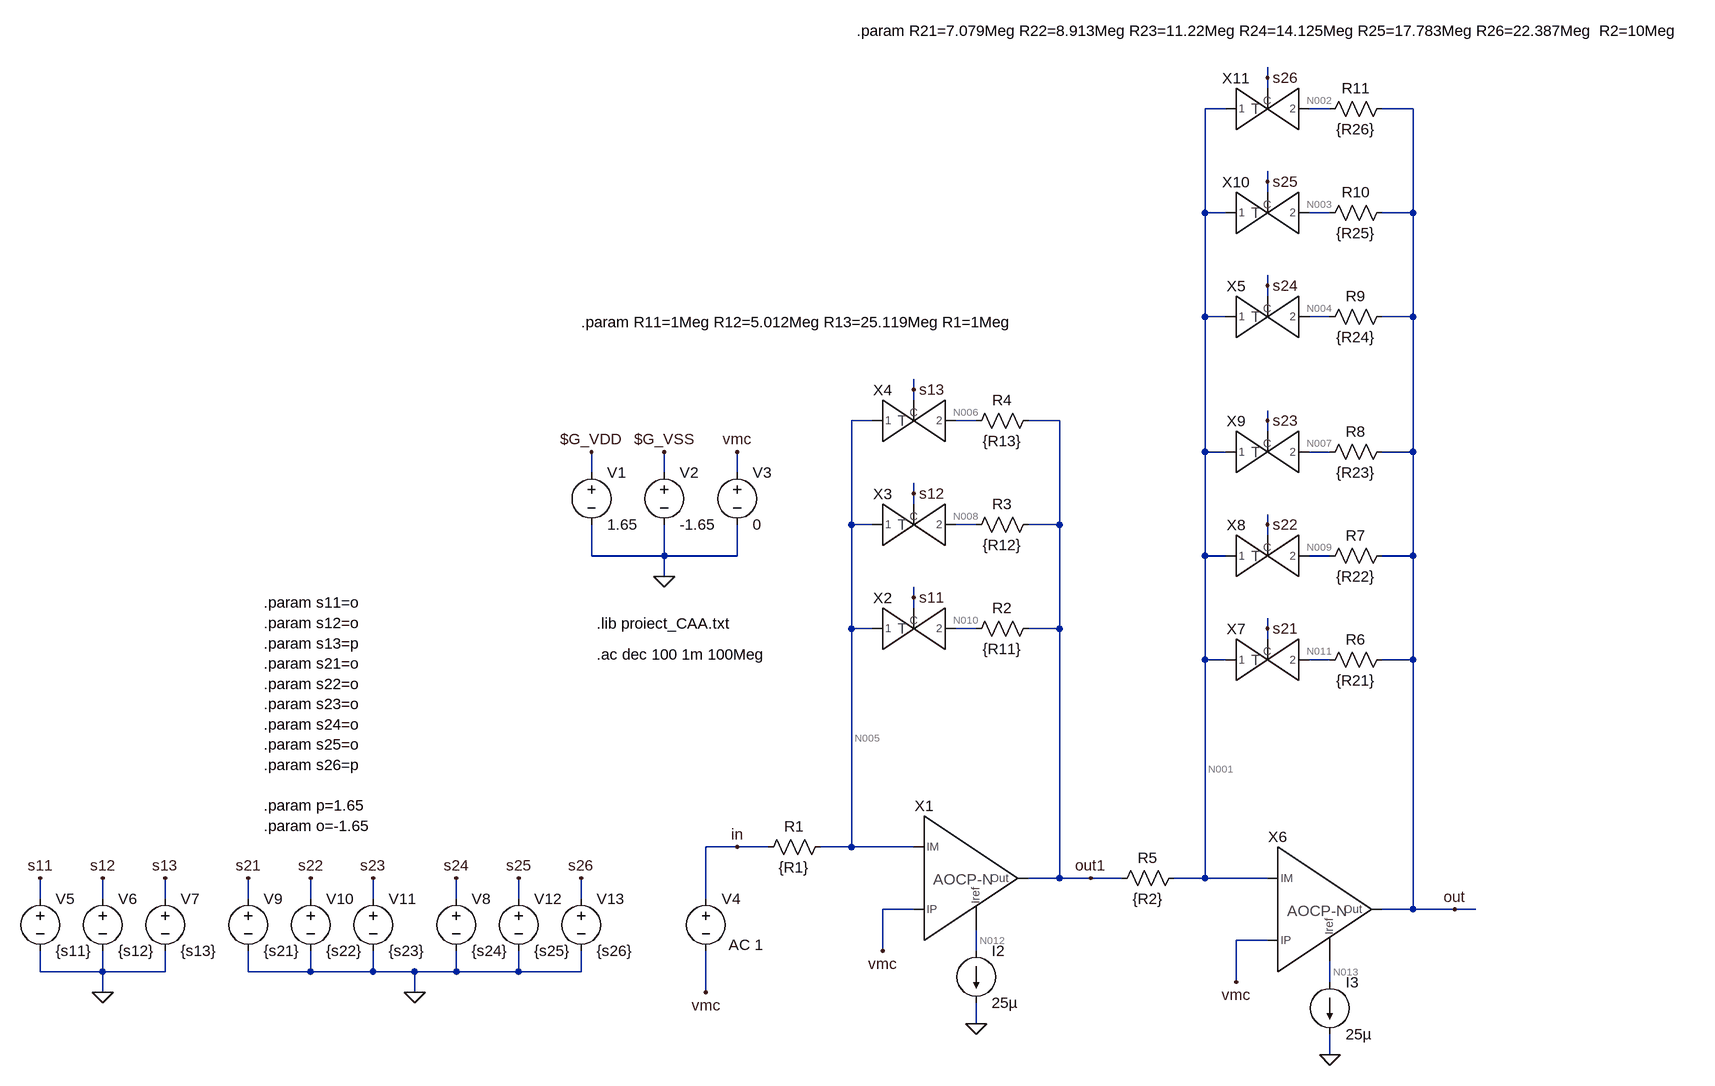
[diagram p0: schematic test_pga2.asc]
test_pga2.asc, the LTspice schematic file:
Version 4
SHEET 1 2632 1328
WIRE 1248 -352 1248 -368
WIRE 1248 -336 1248 -352
WIRE 1184 -304 1152 -304
WIRE 1344 -304 1312 -304
WIRE 1472 -304 1424 -304
WIRE 1248 -192 1248 -208
WIRE 1248 -176 1248 -192
WIRE 1152 -144 1152 -304
WIRE 1184 -144 1152 -144
WIRE 1344 -144 1312 -144
WIRE 1472 -144 1472 -304
WIRE 1472 -144 1424 -144
WIRE 1248 -32 1248 -48
WIRE 1248 -16 1248 -32
WIRE 1152 16 1152 -144
WIRE 1184 16 1152 16
WIRE 1344 16 1312 16
WIRE 1472 16 1472 -144
WIRE 1472 16 1424 16
WIRE 704 128 704 112
WIRE 704 144 704 128
WIRE 640 176 608 176
WIRE 800 176 768 176
WIRE 928 176 880 176
WIRE 1248 176 1248 160
WIRE 1248 192 1248 176
WIRE 1152 224 1152 16
WIRE 1184 224 1152 224
WIRE 1344 224 1312 224
WIRE 1472 224 1472 16
WIRE 1472 224 1424 224
WIRE 208 256 208 224
WIRE 320 256 320 224
WIRE 432 256 432 224
WIRE 704 288 704 272
WIRE 704 304 704 288
WIRE 608 336 608 176
WIRE 640 336 608 336
WIRE 800 336 768 336
WIRE 928 336 928 176
WIRE 928 336 880 336
WIRE 1248 336 1248 320
WIRE 1248 352 1248 336
WIRE 208 384 208 336
WIRE 320 384 320 336
WIRE 320 384 208 384
WIRE 432 384 432 336
WIRE 432 384 320 384
WIRE 1152 384 1152 224
WIRE 1184 384 1152 384
WIRE 1344 384 1312 384
WIRE 1472 384 1472 224
WIRE 1472 384 1424 384
WIRE 320 416 320 384
WIRE 704 448 704 432
WIRE 704 464 704 448
WIRE 608 496 608 336
WIRE 640 496 608 496
WIRE 800 496 768 496
WIRE 928 496 928 336
WIRE 928 496 880 496
WIRE 1248 496 1248 480
WIRE 1248 512 1248 496
WIRE 1152 544 1152 384
WIRE 1184 544 1152 544
WIRE 1344 544 1312 544
WIRE 1472 544 1472 384
WIRE 1472 544 1424 544
WIRE 432 832 384 832
WIRE 480 832 432 832
WIRE 608 832 608 496
WIRE 608 832 560 832
WIRE 704 832 608 832
WIRE 928 880 928 496
WIRE 928 880 880 880
WIRE 976 880 928 880
WIRE 1024 880 976 880
WIRE 1152 880 1152 544
WIRE 1152 880 1104 880
WIRE 1248 880 1152 880
WIRE -640 912 -640 880
WIRE -544 912 -544 880
WIRE -448 912 -448 880
WIRE -320 912 -320 880
WIRE -224 912 -224 880
WIRE -128 912 -128 880
WIRE 0 912 0 880
WIRE 96 912 96 880
WIRE 192 912 192 880
WIRE 384 912 384 832
WIRE 704 928 656 928
WIRE 1472 928 1472 544
WIRE 1472 928 1424 928
WIRE 1536 928 1472 928
WIRE 1568 928 1536 928
WIRE 1248 976 1200 976
WIRE 656 992 656 928
WIRE 800 992 800 960
WIRE -640 1024 -640 992
WIRE -544 1024 -544 992
WIRE -544 1024 -640 1024
WIRE -448 1024 -448 992
WIRE -448 1024 -544 1024
WIRE -320 1024 -320 992
WIRE -224 1024 -224 992
WIRE -224 1024 -320 1024
WIRE -128 1024 -128 992
WIRE -128 1024 -224 1024
WIRE -64 1024 -128 1024
WIRE 0 1024 0 992
WIRE 0 1024 -64 1024
WIRE 96 1024 96 992
WIRE 96 1024 0 1024
WIRE 192 1024 192 992
WIRE 192 1024 96 1024
WIRE 1200 1040 1200 976
WIRE 1344 1040 1344 1008
WIRE -544 1056 -544 1024
WIRE -64 1056 -64 1024
WIRE 384 1056 384 992
WIRE 800 1104 800 1072
WIRE 1344 1152 1344 1120
FLAG 320 416 0
FLAG 208 224 $G_VDD
FLAG 320 224 $G_VSS
FLAG 432 224 vmc
FLAG 656 992 vmc
FLAG 1200 1040 vmc
FLAG 976 880 out1
FLAG 1536 928 out
FLAG 704 448 s11
FLAG 704 288 s12
FLAG 704 128 s13
FLAG 1248 496 s21
FLAG 1248 336 s22
FLAG 1248 176 s23
FLAG -640 880 s11
FLAG 432 832 in
FLAG -544 880 s12
FLAG -448 880 s13
FLAG -320 880 s21
FLAG -224 880 s22
FLAG -128 880 s23
FLAG -544 1056 0
FLAG -64 1056 0
FLAG 384 1056 vmc
FLAG 800 1104 0
FLAG 1344 1152 0
FLAG 1248 -32 s24
FLAG 1248 -192 s25
FLAG 1248 -352 s26
FLAG 0 880 s24
FLAG 96 880 s25
FLAG 192 880 s26
SYMBOL voltage 384 896 R0
WINDOW 3 32 121 Left 2
WINDOW 123 35 87 Left 2
WINDOW 39 0 0 Left 0
SYMATTR Value ""
SYMATTR Value2 AC 1
SYMATTR InstName V4
SYMBOL voltage 208 240 R0
WINDOW 123 0 0 Left 2
WINDOW 39 0 0 Left 2
SYMATTR InstName V1
SYMATTR Value 1.65
SYMBOL voltage 320 240 R0
WINDOW 123 0 0 Left 2
WINDOW 39 0 0 Left 2
SYMATTR InstName V2
SYMATTR Value -1.65
SYMBOL voltage 432 240 R0
WINDOW 123 0 0 Left 2
WINDOW 39 0 0 Left 2
SYMATTR InstName V3
SYMATTR Value 0
SYMBOL res 576 816 R90
WINDOW 0 0 56 VBottom 2
WINDOW 3 32 56 VTop 2
SYMATTR InstName R1
SYMATTR Value {R1}
SYMBOL res 896 480 R90
WINDOW 0 0 56 VBottom 2
WINDOW 3 32 56 VTop 2
SYMATTR InstName R2
SYMATTR Value {R11}
SYMBOL com_tgate 720 496 R0
SYMATTR InstName X2
SYMBOL res 896 320 R90
WINDOW 0 0 56 VBottom 2
WINDOW 3 32 56 VTop 2
SYMATTR InstName R3
SYMATTR Value {R12}
SYMBOL com_tgate 720 336 R0
SYMATTR InstName X3
SYMBOL res 896 160 R90
WINDOW 0 0 56 VBottom 2
WINDOW 3 32 56 VTop 2
SYMATTR InstName R4
SYMATTR Value {R13}
SYMBOL com_tgate 720 176 R0
SYMATTR InstName X4
SYMBOL res 1120 864 R90
WINDOW 0 0 56 VBottom 2
WINDOW 3 32 56 VTop 2
SYMATTR InstName R5
SYMATTR Value {R2}
SYMBOL res 1440 528 R90
WINDOW 0 0 56 VBottom 2
WINDOW 3 32 56 VTop 2
SYMATTR InstName R6
SYMATTR Value {R21}
SYMBOL res 1440 368 R90
WINDOW 0 0 56 VBottom 2
WINDOW 3 32 56 VTop 2
SYMATTR InstName R7
SYMATTR Value {R22}
SYMBOL com_tgate 1264 544 R0
SYMATTR InstName X7
SYMBOL res 1440 208 R90
WINDOW 0 0 56 VBottom 2
WINDOW 3 32 56 VTop 2
SYMATTR InstName R8
SYMATTR Value {R23}
SYMBOL com_tgate 1264 384 R0
SYMATTR InstName X8
SYMBOL com_tgate 1264 224 R0
SYMATTR InstName X9
SYMBOL voltage -640 896 R0
WINDOW 123 0 0 Left 0
WINDOW 39 0 0 Left 0
SYMATTR InstName V5
SYMATTR Value {s11}
SYMBOL voltage -544 896 R0
WINDOW 123 0 0 Left 0
WINDOW 39 0 0 Left 0
SYMATTR InstName V6
SYMATTR Value {s12}
SYMBOL voltage -448 896 R0
WINDOW 123 0 0 Left 0
WINDOW 39 0 0 Left 0
SYMATTR InstName V7
SYMATTR Value {s13}
SYMBOL voltage -320 896 R0
WINDOW 123 0 0 Left 0
WINDOW 39 0 0 Left 0
SYMATTR InstName V9
SYMATTR Value {s21}
SYMBOL voltage -224 896 R0
WINDOW 123 0 0 Left 0
WINDOW 39 0 0 Left 0
SYMATTR InstName V10
SYMATTR Value {s22}
SYMBOL voltage -128 896 R0
WINDOW 123 0 0 Left 0
WINDOW 39 0 0 Left 0
SYMATTR InstName V11
SYMATTR Value {s23}
SYMBOL ao_cp_n 752 880 R0
SYMATTR InstName X1
SYMBOL ao_cp_n 1296 928 R0
SYMATTR InstName X6
SYMBOL current 800 992 R0
WINDOW 123 0 0 Left 0
WINDOW 39 0 0 Left 0
SYMATTR InstName I2
SYMATTR Value 25µ
SYMBOL current 1344 1040 R0
WINDOW 123 0 0 Left 0
WINDOW 39 0 0 Left 0
SYMATTR InstName I3
SYMATTR Value 25µ
SYMBOL res 1440 0 R90
WINDOW 0 0 56 VBottom 2
WINDOW 3 32 56 VTop 2
SYMATTR InstName R9
SYMATTR Value {R24}
SYMBOL res 1440 -160 R90
WINDOW 0 0 56 VBottom 2
WINDOW 3 32 56 VTop 2
SYMATTR InstName R10
SYMATTR Value {R25}
SYMBOL com_tgate 1264 16 R0
SYMATTR InstName X5
SYMBOL res 1440 -320 R90
WINDOW 0 0 56 VBottom 2
WINDOW 3 32 56 VTop 2
SYMATTR InstName R11
SYMATTR Value {R26}
SYMBOL com_tgate 1264 -144 R0
SYMATTR InstName X10
SYMBOL com_tgate 1264 -304 R0
SYMATTR InstName X11
SYMBOL voltage 0 896 R0
WINDOW 123 0 0 Left 0
WINDOW 39 0 0 Left 0
SYMATTR InstName V8
SYMATTR Value {s24}
SYMBOL voltage 96 896 R0
WINDOW 123 0 0 Left 0
WINDOW 39 0 0 Left 0
SYMATTR InstName V12
SYMATTR Value {s25}
SYMBOL voltage 192 896 R0
WINDOW 123 0 0 Left 0
WINDOW 39 0 0 Left 0
SYMATTR InstName V13
SYMATTR Value {s26}
TEXT 192 24 Left 2 !.param R11=1Meg R12=5.012Meg R13=25.119Meg R1=1Meg
TEXT 616 -424 Left 2 !.param R21=7.079Meg R22=8.913Meg R23=11.22Meg R24=14.125Meg R25=17.783Meg R26=22.387Meg  R2=10Meg
TEXT 216 488 Left 2 !.lib proiect_CAA.txt
TEXT 216 536 Left 2 !.ac dec 100 1m 100Meg
TEXT -296 456 Left 2 !.param s11=o\n.param s12=o\n.param s13=p\n.param s21=o\n.param s22=o\n.param s23=o\n.param s24=o\n.param s25=o\n.param s26=p\n \n.param p=1.65\n.param o=-1.65

The netlist it stands for:
* test_pga2.asc
V4 in vmc AC 1
V1 $G_VDD 0 1.65
V2 $G_VSS 0 -1.65
V3 vmc 0 0
R1 N005 in {R1}
R2 out1 N010 {R11}
XX2 N005 s11 N010 com_tgate  ; pins 1 C 2
R3 out1 N008 {R12}
XX3 N005 s12 N008 com_tgate  ; pins 1 C 2
R4 out1 N006 {R13}
XX4 N005 s13 N006 com_tgate  ; pins 1 C 2
R5 N001 out1 {R2}
R6 out N011 {R21}
R7 out N009 {R22}
XX7 N001 s21 N011 com_tgate  ; pins 1 C 2
R8 out N007 {R23}
XX8 N001 s22 N009 com_tgate  ; pins 1 C 2
XX9 N001 s23 N007 com_tgate  ; pins 1 C 2
V5 s11 0 {s11}
V6 s12 0 {s12}
V7 s13 0 {s13}
V9 s21 0 {s21}
V10 s22 0 {s22}
V11 s23 0 {s23}
XX1 N005 vmc out1 N012 ao_cp_n  ; pins IM IP Out Iref
XX6 N001 vmc out N013 ao_cp_n  ; pins IM IP Out Iref
I2 N012 0 25µ
I3 N013 0 25µ
R9 out N004 {R24}
R10 out N003 {R25}
XX5 N001 s24 N004 com_tgate  ; pins 1 C 2
R11 out N002 {R26}
XX10 N001 s25 N003 com_tgate  ; pins 1 C 2
XX11 N001 s26 N002 com_tgate  ; pins 1 C 2
V8 s24 0 {s24}
V12 s25 0 {s25}
V13 s26 0 {s26}
.param R11=1Meg R12=5.012Meg R13=25.119Meg R1=1Meg
.param R21=7.079Meg R22=8.913Meg R23=11.22Meg R24=14.125Meg R25=17.783Meg R26=22.387Meg  R2=10Meg
.lib proiect_CAA.txt
.ac dec 100 1m 100Meg
.param s11=o
.param s12=o
.param s13=p
.param s21=o
.param s22=o
.param s23=o
.param s24=o
.param s25=o
.param s26=p
.param p=1.65
.param o=-1.65
.backanno
.end

* Results of the author's LTspice run, read from the files saved beside the schematic
* Operating Point, zero values left out:
*   V($g_vdd) = 1.65 V
*   V($g_vss) = -1.65 V
*   V(n005) = -6.267 µV
*   V(out1) = -495.3 µV
*   V(n010) = -492 µV
*   V(s11) = -1.65 V
*   V(n008) = -478.8 µV
*   V(s12) = -1.65 V
*   V(n006) = -6.314 µV
*   V(s13) = 1.65 V
*   V(n001) = -6.355 µV
*   V(out) = 571.2 µV
*   V(n011) = 594.6 µV
*   V(n009) = 600.6 µV
*   V(s21) = -1.65 V
*   V(n007) = 608.2 µV
*   V(s22) = -1.65 V
*   V(s23) = -1.65 V
*   V(n012) = 251.8 mV
*   V(n013) = 251.8 mV
*   V(n004) = 617.8 µV
*   V(n003) = 629.8 µV
*   V(s24) = -1.65 V
*   V(n002) = -6.27 µV
*   V(s25) = -1.65 V
*   V(s26) = 1.65 V
*   I(I3) = 25 µA
*   I(I2) = 25 µA
*   I(R11) = 25.8 pA
*   I(R10) = -3.297 pA
*   I(R9) = -3.298 pA
*   I(R8) = -3.298 pA
*   I(R7) = -3.298 pA
*   I(R6) = -3.298 pA
*   I(R5) = 48.9 pA
*   I(R4) = -19.47 pA
*   I(R3) = -3.302 pA
*   I(R2) = -3.302 pA
*   I(R1) = -6.267 pA
*   I(V3) = -6.267 pA
*   I(V2) = 574 µA
*   I(V1) = -624 µA
*   I(V4) = -6.267 pA
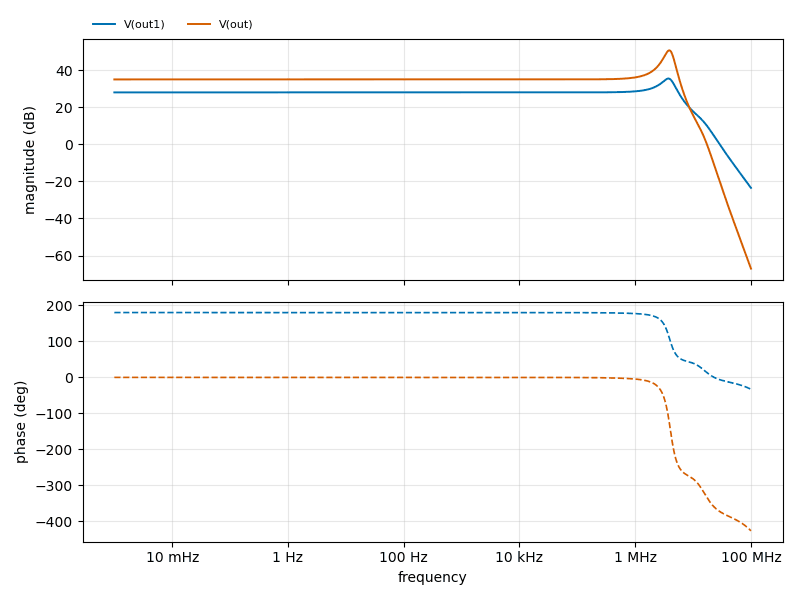
[diagram p1: AC Analysis of test_pga2.asc, plotted from the saved traces]
* AC Analysis, 1 run:
*   V(out1): 27.97 dB at 1 mHz, -23.55 dB at 100 MHz, peak 35.45 dB at 3.715 MHz, 3 dB below the peak at 2.678 MHz and 4.635 MHz
*   V(out): 34.97 dB at 1 mHz, -67.03 dB at 100 MHz, peak 50.64 dB at 3.89 MHz, 3 dB below the peak at 3.223 MHz and 4.463 MHz